# Altium schematic sheet BLDC_Motor_Reversal_Rev1.SchDoc
size A4; SheetNumber: 1; SheetTotal: 1
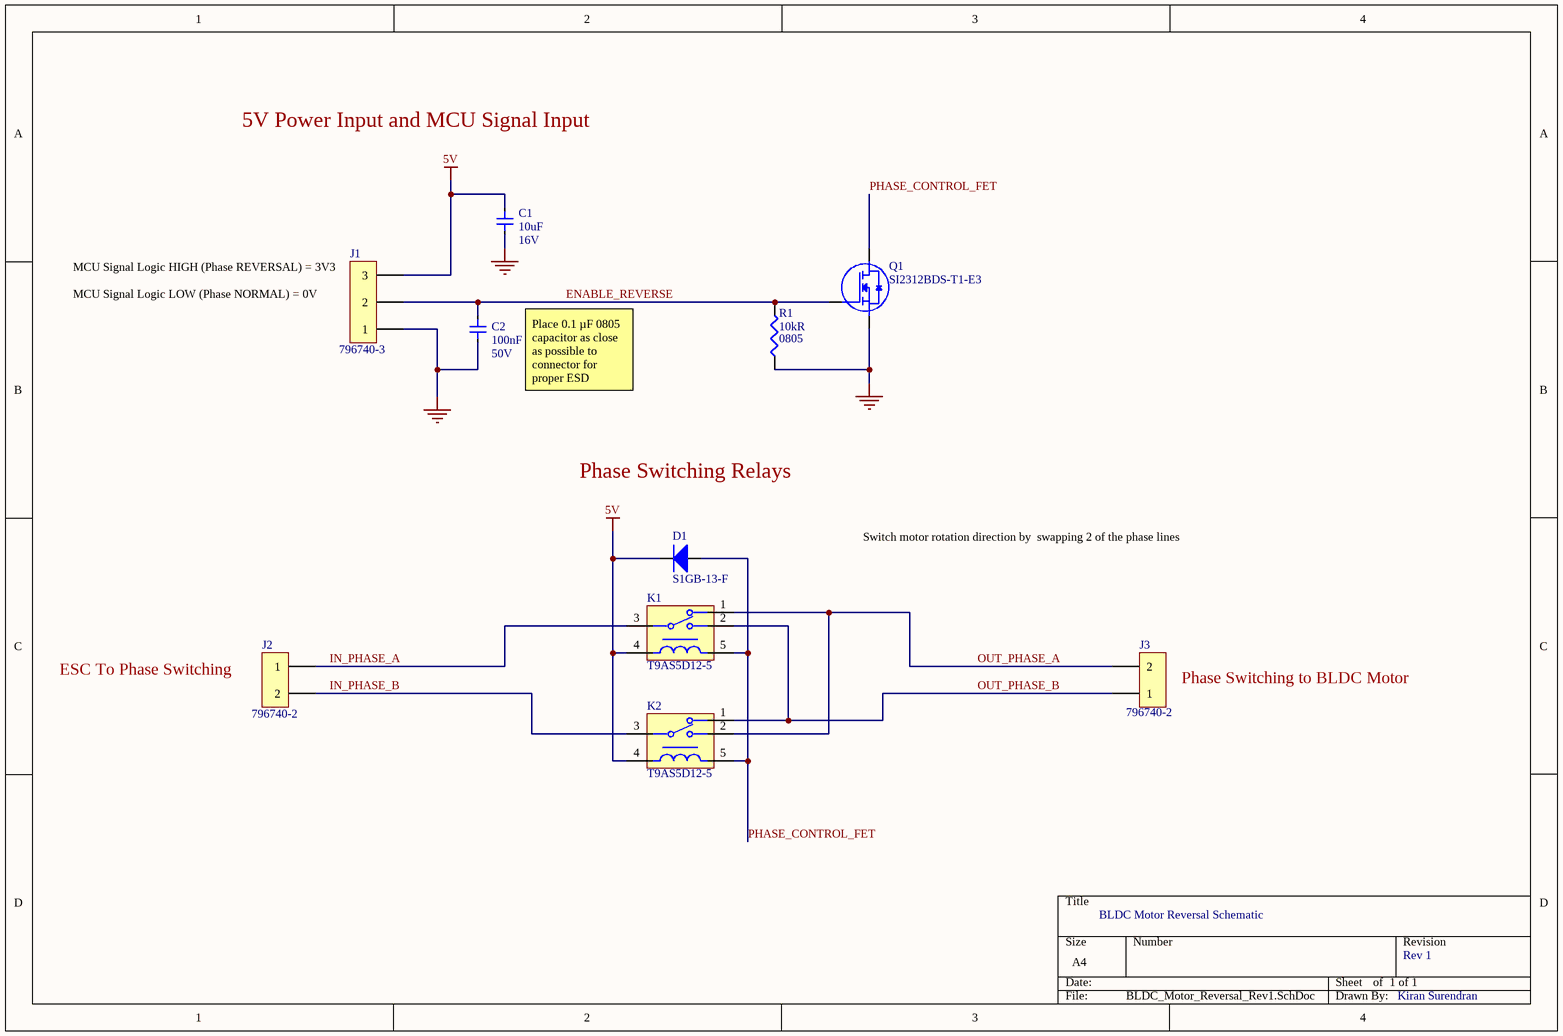
[diagram p0: BLDC_Motor_Reversal_Rev1.SchDoc]

## Parts
C1  Voltage Rating: 16V  Capacitance: 10uF  [C0805C106K4PACTU]  (hidden comment: C0805C106K4PACTU)
C2  Voltage Rating: 50V  Capacitance: 100nF  [C0805C104K5RACTU]  (hidden comment: C0805C104K5RACTU)
D1  S1GB-13-F  [S1GB-13-F]
J1  796740-3  [796740-3]
J2  796740-2  [796740-2]
J3  796740-2  [796740-2]
K1  T9AS5D12-5  [T9AS5D12-5]
K2  T9AS5D12-5  [T9AS5D12-5]
Q1  SI2312BDS-T1-E3  [SI2312BDS-T1-E3]
R1  Package: 0805  Resistance: 10kR  [RC0805JR-0710KL]  (hidden comment: RC0805JR-0710KL)

## Nets
5V: C1.2 D1.1(-) J1.3 K1.4 K2.4
GND: C1.1 C2.1 J1.1 Q1.2(Source) R1.1
ENABLE_REVERSE: C2.2 J1.2 Q1.1(Gate) R1.2
IN_PHASE_A: J2.1 K1.3(COM)
IN_PHASE_B: J2.2 K2.3(COM)
OUT_PHASE_A: J3.2 K1.1(NC) K2.2(NO)
OUT_PHASE_B: J3.1 K1.2(NO) K2.1(NC)
PHASE_CONTROL_FET: D1.2(+) K1.5 K2.5 Q1.3(Drain)

## Notes on the sheet
- 5V Power Input and MCU Signal Input
- (near J1) MCU Signal Logic HIGH (Phase REVERSAL) = 3V3
- MCU Signal Logic LOW (Phase NORMAL) = 0V
- (near C2) Place 0.1 µF 0805 capacitor as close as possible to connector for proper ESD protection
- Phase Switching Relays
- Switch motor rotation direction by
  swapping 2 of the phase lines
- (near J2) ESC To Phase Switching
- (near J3) Phase Switching to BLDC Motor
- BLDC Motor Reversal Schematic
- 1 of 1
- Rev 1
- Kiran Surendran

## Library data of the parts
C1 = C0805C106K4PACTU: CERAMIC CAPACITOR, 10UF, 16V, X5R, 10%, 0805; Manufacturer 1: KEMET; Supplier 1: Digi-Key; Supplier Part Number 1: 399-8012-1-ND; Manufacturer Part Number 1: C0805C106K4PACTU; Case/Package: 0805
C2 = C0805C104K5RACTU: Cap Ceramic 0.1uF 50V X7R 10% SMD 2.0 x 1.2 mm 125 C Paper T/R; Manufacturer 1: KEMET; Manufacturer Part Number 1: C0805C104K5RACTU; Case/Package: 0805; Supplier 1: Digi-Key; Supplier Part Number 1: 399-1170-1-ND
D1 = S1GB-13-F: DIODE GEN PURP 400V 1A SMB; Manufacturer 1: Diodes Incorporated; VRRM: 325V; IFSM: 8.0A; Manufacturer Part Number 1: S1GB-13-F; Supplier 1: Digi-Key; Supplier Part Number 1: S1GB-FDICT-ND
J1 = 796740-3: TERM BLK 3P SIDE ENT 6.35MM PCB; Manufacturer 1: TE Connectivity AMP Connectors; Supplier Part Number 1: A98276-ND; Manufacturer Part Number 1: 796740-3; Supplier 1: Digi-Key
J2 J3 = 796740-2: TERMINAL BLOCK, PLUG, 2POS, 24-10AWG; Manufacturer: TE Connectivity; Current Rating: 30A; Voltage Rating: 300V; Supplier 1: Digi-Key; Supplier Part Number 1: A98275-ND; Manufacturer Part Number: 796740-2
K1 K2 = T9AS5D12-5: RELAY GEN PURPOSE SPDT 20A 5V; Manufacturer 1: TE Connectivity Potter & Brumfield Relays; Contact Voltage Rating (AC): 277V; Current Rating: 30A; Coil Current: 200mA; Voltage Rating (DC): 5V; Coil Voltage (DC): 5V; Contact Current Rating: 20A; Manufacturer Part Number 1: T9AS5D12-5; Supplier 1: Digi-Key; Supplier Part Number 1: T9AS5D12-5-ND
Q1 = SI2312BDS-T1-E3: MOSFET; Manufacturer 1: Vishay Siliconix; Manufacturer Part Number 1: SI2312BDS-T1-E3; Supplier 1: Digi-Key; Supplier Part Number 1: SI2312BDS-T1-E3CT-ND
R1 = RC0805JR-0710KL: Res Thick Film 0805 10K Ohm 5% 1/8W ±100ppm/°C Molded SMD Paper T/R; Manufacturer 1: Yageo; Supplier 1: Digi-Key; Supplier Part Number 1: 311-10KARCT-ND; Manufacturer Part Number 1: RC0805JR-0710KL; Tolerance: 5%